# EasyEDA Pro project ir2104_V2.0.eprj

# Schematic Schematic1
Create Date: 2023-10-16; Page Name: P1_1; Project Name: ir2104_V2; Schematic Name: Schematic1; Update Date: 2023-10-16; Company: 嘉立创EDA; Page Size: A4; Version: V1.0
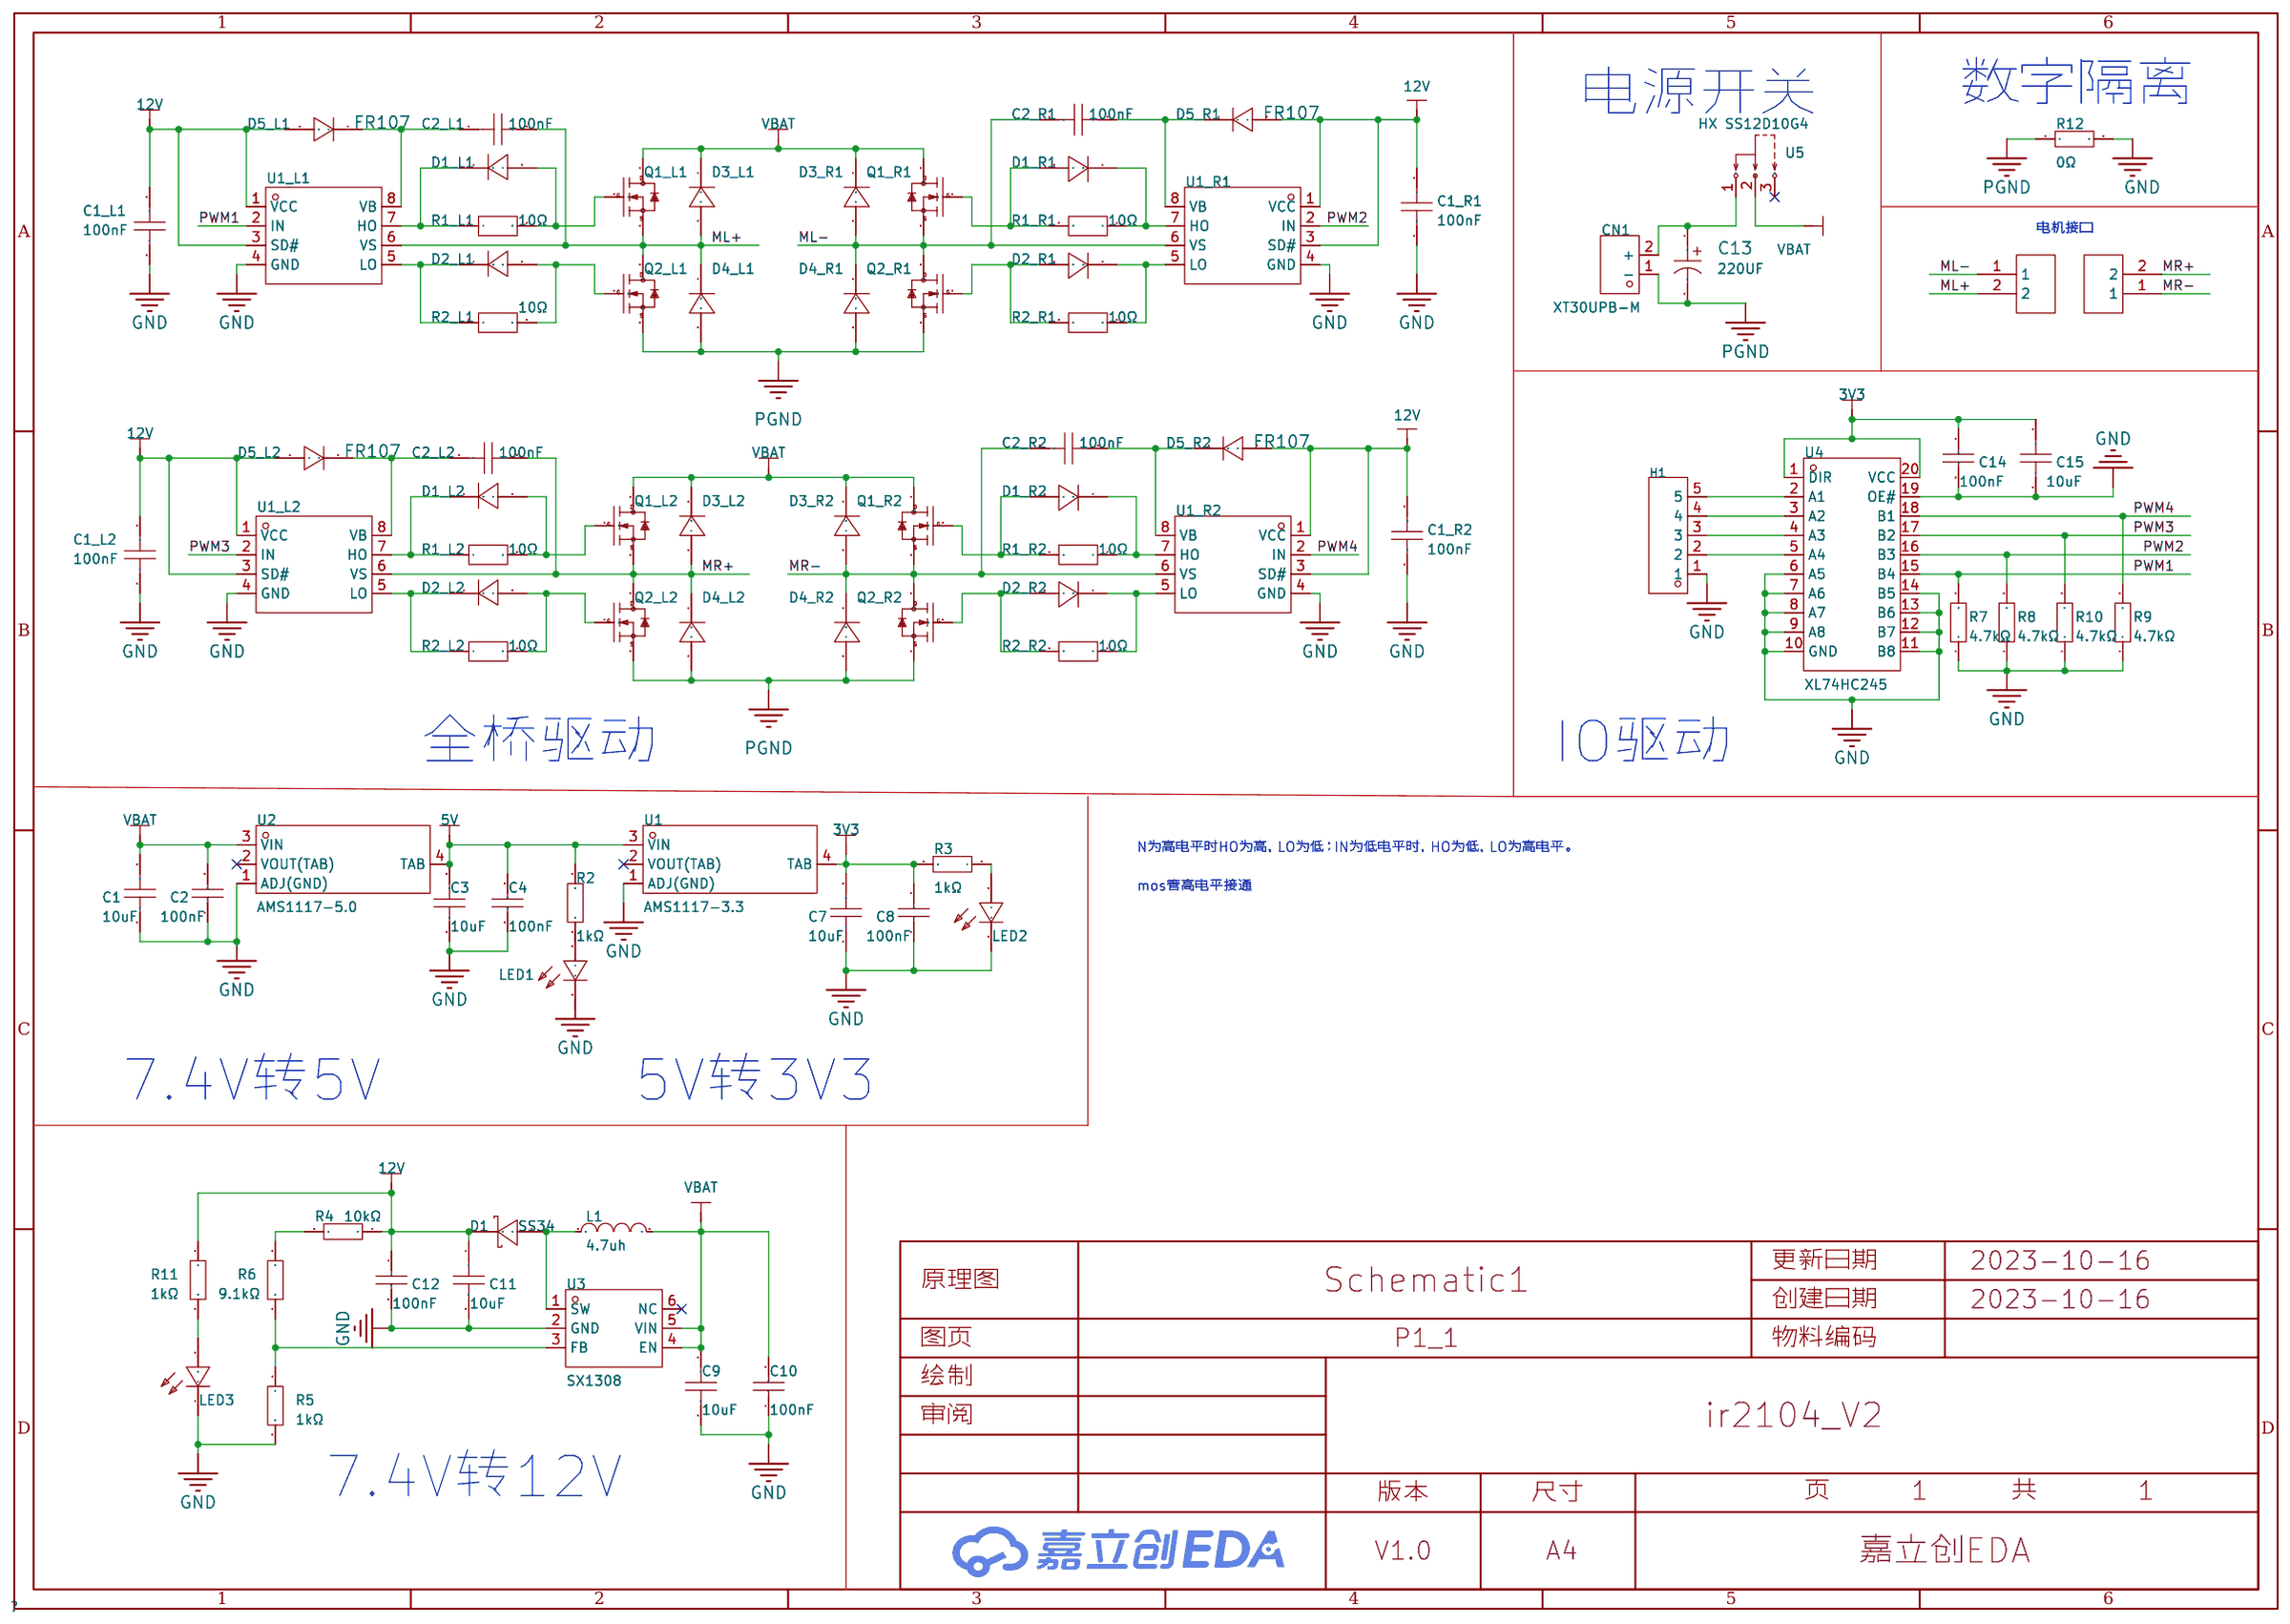
[diagram p0: schematic sheet]

## Parts
C1  10uF  [C0603]
C1_L1  100nF  [C0603]
C1_L2  100nF  [C0603]
C1_R1  100nF  [C0603]
C1_R2  100nF  [C0603]
C2  100nF  [C0603]
C2_L1  100nF  [C0603]
C2_L2  100nF  [C0603]
C2_R1  100nF  [C0603]
C2_R2  100nF  [C0603]
C3  10uF  [C0603]
C4  100nF  [C0603]
C7  10uF  [C0603]
C8  100nF  [C0603]
C9  10uF  [C0603]
C10  100nF  [C0603]
C11  10uF  [C0603]
C12  100nF  [C0603]
C13  220UF  [CAP-SMD_BD8.0-L8.3-W8.3-LS9.3-FD]
C14  100nF  [C0603]
C15  10uF  [C0603]
CN1  XT30UPB-M  [CONN-TH_XT30UPB-M]
D1  SS34  [SMA_L4.3-W2.6-LS5.2-RD]
D1_L1  US1M  [SMA_L4.4-W2.8-LS5.4-RD]
D1_L2  US1M  [SMA_L4.4-W2.8-LS5.4-RD]
D1_R1  US1M  [SMA_L4.4-W2.8-LS5.4-RD]
D1_R2  US1M  [SMA_L4.4-W2.8-LS5.4-RD]
D2_L1  US1M  [SMA_L4.4-W2.8-LS5.4-RD]
D2_L2  US1M  [SMA_L4.4-W2.8-LS5.4-RD]
D2_R1  US1M  [SMA_L4.4-W2.8-LS5.4-RD]
D2_R2  US1M  [SMA_L4.4-W2.8-LS5.4-RD]
D3_L1  US1M  [SMA_L4.4-W2.8-LS5.4-RD]
D3_L2  US1M  [SMA_L4.4-W2.8-LS5.4-RD]
D3_R1  US1M  [SMA_L4.4-W2.8-LS5.4-RD]
D3_R2  US1M  [SMA_L4.4-W2.8-LS5.4-RD]
D4_L1  US1M  [SMA_L4.4-W2.8-LS5.4-RD]
D4_L2  US1M  [SMA_L4.4-W2.8-LS5.4-RD]
D4_R1  US1M  [SMA_L4.4-W2.8-LS5.4-RD]
D4_R2  US1M  [SMA_L4.4-W2.8-LS5.4-RD]
D5_L1  FR107  [SOD-123_L2.8-W1.8-LS3.7-RD]
D5_L2  FR107  [SOD-123_L2.8-W1.8-LS3.7-RD]
D5_R1  FR107  [SOD-123_L2.8-W1.8-LS3.7-RD]
D5_R2  FR107  [SOD-123_L2.8-W1.8-LS3.7-RD]
H1  PZ254V-11-05P  [HDR-TH_5P-P2.54-V-M]
L1  4.7uh  [IND-SMD_L7.3-W6.6]
LED1  NCD0603R1  [LED0603-RD_RED]
LED2  NCD0603R1  [LED0603-RD_RED]
LED3  NCD0603R1  [LED0603-RD_RED]
P1  WJ500V-5.08-2P  [CONN-TH_2P-P5.00_WJ500V-5.08-2P]
P2  WJ500V-5.08-2P  [CONN-TH_2P-P5.00_WJ500V-5.08-2P]
Q1_L1  IRFR3607TRPBF  [TO-252-3_L6.5-W5.8-P4.58-BL]
Q1_L2  IRFR3607TRPBF  [TO-252-3_L6.5-W5.8-P4.58-BL]
Q1_R1  IRFR3607TRPBF  [TO-252-3_L6.5-W5.8-P4.58-BL]
Q1_R2  IRFR3607TRPBF  [TO-252-3_L6.5-W5.8-P4.58-BL]
Q2_L1  IRFR3607TRPBF  [TO-252-3_L6.5-W5.8-P4.58-BL]
Q2_L2  IRFR3607TRPBF  [TO-252-3_L6.5-W5.8-P4.58-BL]
Q2_R1  IRFR3607TRPBF  [TO-252-3_L6.5-W5.8-P4.58-BL]
Q2_R2  IRFR3607TRPBF  [TO-252-3_L6.5-W5.8-P4.58-BL]
R1_L1  10Ω  [R0603]
R1_L2  10Ω  [R0603]
R1_R1  10Ω  [R0603]
R1_R2  10Ω  [R0603]
R2  1kΩ  [R0603]
R2_L1  10Ω  [R0603]
R2_L2  10Ω  [R0603]
R2_R1  10Ω  [R0603]
R2_R2  10Ω  [R0603]
R3  1kΩ  [R0603]
R4  10kΩ  [R0603]
R5  1kΩ  [R0603]
R6  9.1kΩ  [R0603]
R7  4.7kΩ  [R0603]
R8  4.7kΩ  [R0603]
R9  4.7kΩ  [R0603]
R10  4.7kΩ  [R0603]
R11  1kΩ  [R0603]
R12  0Ω  [R0805]
U1  AMS1117-3.3  [SOT-223-4_L6.5-W3.5-P2.30-LS7.0-BR]
U1_L1  EG2104  [SOP-8_L5.0-W4.0-P1.27-LS6.2-BL]
U1_L2  EG2104  [SOP-8_L5.0-W4.0-P1.27-LS6.2-BL]
U1_R1  EG2104  [SOP-8_L5.0-W4.0-P1.27-LS6.2-BL]
U1_R2  EG2104  [SOP-8_L5.0-W4.0-P1.27-LS6.2-BL]
U2  AMS1117-5.0  [SOT-223_L6.7-W3.5-P2.30-BR]
U3  SX1308  [SOT-23-6_L2.9-W1.6-P0.95-LS2.8-BL]
U4  XL74HC245  [SOP-20_L12.8-W7.5-P1.27-LS10.4-BL]
U5  HX SS12D10G4  [SW-TH_SHOU-HAN_SS12D10G4]

## Library data of the parts
C1 C3 C7 C9 C11 C15 = CL10A106MA8NRNC: 容值:10uF;精度:±20%;额定电压:25V;材质(温度系数):X5R;; LCSC Part Name: 10uF ±20% 25V; Supplier Part: C96446; Manufacturer: SAMSUNG(三星); Supplier Footprint: 0603; JLCPCB Part Class: Basic Part; Datasheet: https://atta.szlcsc.com/upload/public/pdf/source/20170325/1490427913016.pdf; Supplier: LCSC; Tolerance: ±20%; Voltage Rated: 25V; Temperature Coefficient: X5R
C1_L1 C1_L2 C1_R1 C1_R2 C2_L1 C2_L2 C2_R1 C2_R2 = CL10B104KB8NNNC: 容值:100nF;精度:±10%;额定电压:50V;材质(温度系数):X7R;; LCSC Part Name: 100nF±10%50V; Supplier Part: C1591; Manufacturer: SAMSUNG(三星); Supplier Footprint: 0603; JLCPCB Part Class: 扩展库; Datasheet: https://atta.szlcsc.com/upload/public/pdf/source/20160103/1457707680512.pdf; Supplier: LCSC; Tolerance: ±10%; Voltage Rated: 50V; Temperature Coefficient: X7R
C2 C4 C8 C10 C12 C14 = 0603B104K500NT: 容值:100nF;精度:±10%;额定电压:50V;材质(温度系数):X7R;; LCSC Part Name: 100nF ±10% 50V; Supplier Part: C30926; Manufacturer: FH(风华); Supplier Footprint: 0603; JLCPCB Part Class: Extended Part; Datasheet: https://atta.szlcsc.com/upload/public/pdf/source/20170923/C30926_1506149436298988724.pdf; Supplier: LCSC; Tolerance: ±10%; Voltage Rated: 50V; Temperature Coefficient: X7R
C13 = FZ470UF16V90RV0148: LCSC Part Name: 贴片型铝电解电容 470UF 16V; Supplier Part: C5155342; Manufacturer: KNSCHA(科尼盛); Supplier Footprint: SMD,8x10.5mm; JLCPCB Part Class: Extended Part; Supplier: LCSC
CN1 = XT30UPB-M: LCSC Part Name: AMASS(艾迈斯)板载立式 航模锂电池控制器连接器插头 公头XT30UPB-M; Supplier Part: C428721; Manufacturer: AMASS(艾迈斯); JLCPCB Part Class: Extended Part; Datasheet: https://atta.szlcsc.com/upload/public/pdf/source/20230412/7B5DFEF57C9EA5273853390C734B3AC5.pdf; Supplier: LCSC
D1 = SS34_C8678: 二极管配置:独立式;直流反向耐压(Vr):40V;平均整流电流(Io):3A;正向压降(Vf):550mV@3A;; LCSC Part Name: 40V 3A 550mV@3A; Supplier Part: C8678; Manufacturer: MDD; Supplier Footprint: SMA(DO-214AC); JLCPCB Part Class: Basic Part; Datasheet: https://atta.szlcsc.com/upload/public/pdf/source/20230314/A80AE34493C69B89E2F4B1712F433538.pdf; Supplier: LCSC; Diode Configuration: 独立式; Reverse Voltage (Vr): 40V; Average Rectified Current (Io): 3A; Forward Voltage (Vf@If): 550mV@3A; Reverse Leakage Current (Ir): 500uA@40V
D1_L1 D1_L2 D1_R1 D1_R2 D2_L1 D2_L2 D2_R1 D2_R2 D3_L1 D3_L2 D3_R1 D3_R2 D4_L1 D4_L2 D4_R1 D4_R2 = US1M_C412437: 二极管配置:独立式;直流反向耐压(Vr):1kV;平均整流电流(Io):1A;正向压降(Vf):1.7V@1A;反向电流(Ir):5uA@1kV;反向恢复时间(trr):75ns;工作温度:-50℃~+150℃@(Tj);; LCSC Part Name: 1kV1A75ns; Supplier Part: C412437; Manufacturer: MDD; Supplier Footprint: SMA; JLCPCB Part Class: BasicPart; Datasheet: https://atta.szlcsc.com/upload/public/pdf/source/20200710/C412437_A2B0E4A2AF6F53946A2ACCD8257B288E.pdf; Supplier: LCSC; Diode Configuration: 独立式; Reverse Voltage (Vr): 1kV; Average Rectified Current (Io): 1A; Forward Voltage (Vf@If): 1.7V@1A; Reverse Leakage Current: 5uA@1kV; Reverse Recovery Time (trr): 75ns; Operating Temperature: -50℃~+150℃@(Tj)
D5_L1 D5_L2 D5_R1 D5_R2 = FR107_C511885: 二极管配置:-;直流反向耐压(Vr):1kV;平均整流电流(Io):1A;正向压降(Vf):1.3V@1A;反向电流(Ir):5uA@1kV;反向恢复时间(trr):500ns;工作温度:-55℃~+150℃@(Tj);; LCSC Part Name: 1kV1A500ns; Supplier Part: C511885; Manufacturer: BORN(伯恩半导体); Supplier Footprint: SOD-123; JLCPCB Part Class: 扩展库; Datasheet: https://atta.szlcsc.com/upload/public/pdf/source/20200413/C511885_F5BBF7A87475723E74BE0D118A106A7A.pdf; Supplier: LCSC; Reverse Voltage (Vr): 1kV; Average Rectified Current (Io): 1A; Forward Voltage (Vf@If): 1.3V@1A; Reverse Leakage Current: 5uA@1kV; Reverse Recovery Time (trr): 500ns; Operating Temperature: -55℃~+150℃@(Tj)
H1 = PZ254V-11-05P: 排数:单排;总PIN位数:5P;间距:2.54mm;插针结构:1x5P;行距:-;安装类型:直插;圆针/方针:方针;额定电流:-;额定电压:-;配合针长度:6mm;塑高:2.5mm;端接针长度:3mm;触头材质:黄铜;触头镀层:-;工作温度范围:-40℃~+105℃;颜色:黑色;; LCSC Part Name: 2.54mm 1x5P 直插 方针; Supplier Part: C492404; Manufacturer: XFCN(兴飞); Supplier Footprint: 插件,P=2.54mm; JLCPCB Part Class: Extended Part; Datasheet: https://atta.szlcsc.com/upload/public/pdf/source/20200309/C492404_E51533260F8710EFF5D4617281164C1D.pdf; Supplier: LCSC; Number of Rows: 单排; Number of Pins: 5P; Pitch: 2.54mm; Pin Structure: 1x5P; Mounting Type: 直插; Circluar Pins/Square Pins: 方针; Length of Mating Pin: 6mm; Insulation Height: 2.5mm; Length of End Connection Pin: 3mm; Contact Material: 黄铜; Operating Temperature Range: -40℃~+105℃; Color: 黑色
L1 = SMMS0630-100M: 电感值:10uH;精度:±20%;额定电流:-;; LCSC Part Name: 10uH ±20%; Supplier Part: C128692; Manufacturer: SXN(顺翔诺); Supplier Footprint: SMD,6.6x7.3mm; JLCPCB Part Class: 扩展库; Datasheet: https://atta.szlcsc.com/upload/public/pdf/source/20210810/BBF24330FB2F5029F637830BA9C42C0D.pdf; Supplier: LCSC; Tolerance: ±20%
LED1-LED3 = NCD0603R1_C84263: 发光颜色:红灯;; LCSC Part Name: 红灯; Supplier Part: C84263; Manufacturer: 国星光电; Supplier Footprint: 0603; JLCPCB Part Class: Extended Part; Datasheet: https://atta.szlcsc.com/upload/public/pdf/source/20200820/C84263_DABC6A75E58F576973B407FDBA283D60.pdf; Supplier: LCSC; Emitted Color: 红灯
P1 P2 = WJ500V-5.08-2P: 间距:5.08mm;结构:1x2P;排数:1;每排PIN数:2;安装方式:直针;额定电流:18A;额定电压:250V;线规 - AWG:14~30;线规 - mm2:2.5;工作温度范围:-40℃~+105℃;颜色:绿色;; LCSC Part Name: 5.08mm 1x2P 排数:1 每排P数:2 直针 可拼接; Supplier Part: C8465; Manufacturer: KANGNEX(康奈克斯电气); Supplier Footprint: 插件,P=5.08mm; JLCPCB Part Class: 扩展库; Datasheet: https://atta.szlcsc.com/upload/public/pdf/source/20191225/C8465_02D34CE5B5B4A53DF5891601D97FA9F4.pdf; Supplier: LCSC; Pitch: 5.08mm; Structure: 1x2P; Number of Rows: 1; Number of PINs Per Row: 2; Mounting Style: 直针; Current Rating (Max): 18A; Voltage Rating (Max): 250V; Wire Gauge - AWG: 14~30; Wire Gauge - mm2: 2.5; Operating Temperature Range: -40℃~+105℃; Color: 绿色
Q1_L1 Q1_L2 Q1_R1 Q1_R2 Q2_L1 Q2_L2 Q2_R1 Q2_R2 = IRFR3607TRPBF: 类型:N沟道;漏源电压(Vdss):75V;连续漏极电流(Id):56A;功率(Pd):140W;导通电阻(RDS(on)@Vgs,Id):9mΩ@10V,46A;阈值电压(Vgs(th)@Id):4V@100uA;; LCSC Part Name: N沟道75V56A; Supplier Part: C74775; Manufacturer: Infineon(英飞凌); Supplier Footprint: TO-252-2(DPAK); JLCPCB Part Class: 扩展库; Datasheet: https://atta.szlcsc.com/upload/public/pdf/source/20180125/C74775_15168616818461301901.pdf; Supplier: LCSC; Type: N沟道; Drain Source Voltage (Vdss): 75V; Continuous Drain Current (Id): 56A; Power Dissipation (Pd): 140W; Drain Source On Resistance (RDS(on)@Vgs,Id): 9mΩ@10V,46A; Gate Threshold Voltage (Vgs(th)@Id): 4V@100uA
R1_L1 R1_L2 R1_R1 R1_R2 R2_L1 R2_L2 R2_R1 R2_R2 = ERJUP3D10R0V: 阻值:10Ω;精度:±0.5%;功率:250mW;; LCSC Part Name: 10Ω±0.5%250mW; Supplier Part: C491216; Manufacturer: PANASONIC(松下); Supplier Footprint: 0603; JLCPCB Part Class: 扩展库; Datasheet: https://atta.szlcsc.com/upload/public/pdf/source/20200407/C491216_2E39EC09AE614A2EE2B1246D53854D38.pdf; Supplier: LCSC; Tolerance: ±0.5%; Power(Watts): 250mW
R2 R3 R11 = 0603WAF1001T5E: 电阻类型:厚膜电阻;阻值:1kΩ;精度:±1%;功率:100mW;; LCSC Part Name: 1kΩ ±1% 100mW; Supplier Part: C21190; Manufacturer: UNI-ROYAL(厚声); Supplier Footprint: 0603; JLCPCB Part Class: Basic Part; Datasheet: https://atta.szlcsc.com/upload/public/pdf/source/20200306/C422600_1E6D84923E4A46A82E41ADD87F860B5C.pdf; Supplier: LCSC; Type: 厚膜电阻; Tolerance: ±1%; Power(Watts): 100mW; Temperature Coefficient: ±100ppm/℃; Overload Voltage (Max): 75V; Operating Temperature Range: -55℃~+155℃
R4 = RT0603BRD0710KL: 电阻类型:薄膜电阻;阻值:10kΩ;精度:±0.1%;功率:100mW;; LCSC Part Name: 10kΩ ±0.1% 100mW; Supplier Part: C95204; Manufacturer: YAGEO(国巨); Supplier Footprint: 0603; JLCPCB Part Class: Extended Part; Datasheet: https://atta.szlcsc.com/upload/public/pdf/source/20170217/1487301593756.pdf; Supplier: LCSC; Type: 薄膜电阻; Tolerance: ±0.1%; Power(Watts): 100mW; Temperature Coefficient: ±25ppm/℃; Overload Voltage (Max): 75V; Operating Temperature Range: -55℃~+155℃
R5 = RT0603BRD071KL: 电阻类型:薄膜电阻;阻值:1kΩ;精度:±0.1%;功率:100mW;; LCSC Part Name: 1kΩ ±0.1% 100mW; Supplier Part: C110776; Manufacturer: YAGEO(国巨); Supplier Footprint: 0603; JLCPCB Part Class: Extended Part; Datasheet: https://atta.szlcsc.com/upload/public/pdf/source/20170704/1499151282044.pdf; Supplier: LCSC; Type: 薄膜电阻; Tolerance: ±0.1%; Power(Watts): 100mW; Temperature Coefficient: ±25ppm/℃; Overload Voltage (Max): 75V; Operating Temperature Range: -55℃~+155℃
R6 = PTFR0603B9K10P9: 电阻类型:薄膜电阻;阻值:9.1kΩ;精度:±0.1%;功率:100mW;; LCSC Part Name: 9.1kΩ ±0.1% 100mW; Supplier Part: C351620; Manufacturer: RESI(开步睿思）; Supplier Footprint: 0603; JLCPCB Part Class: Extended Part; Datasheet: https://atta.szlcsc.com/upload/public/pdf/source/20200421/C328426_1F8A6F869BB4A34F9E140D3E05CCCC70.pdf; Supplier: LCSC; Type: 薄膜电阻; Tolerance: ±0.1%; Power(Watts): 100mW; Temperature Coefficient: ±25ppm/℃; Overload Voltage (Max): 100V; Operating Temperature Range: -55℃~+125℃
R7-R10 = 0603WAF4701T5E: 电阻类型:厚膜电阻;阻值:4.7kΩ;精度:±1%;功率:100mW;; LCSC Part Name: 4.7kΩ ±1% 100mW; Supplier Part: C23162; Manufacturer: UNI-ROYAL(厚声); Supplier Footprint: 0603; JLCPCB Part Class: Basic Part; Datasheet: https://atta.szlcsc.com/upload/public/pdf/source/20200306/C422600_1E6D84923E4A46A82E41ADD87F860B5C.pdf; Supplier: LCSC; Type: 厚膜电阻; Tolerance: ±1%; Power(Watts): 100mW; Temperature Coefficient: ±100ppm/℃; Overload Voltage (Max): 75V; Operating Temperature Range: -55℃~+155℃
R12 = 0805W8F0000T5E: 电阻类型:厚膜电阻;阻值:0Ω;精度:±1%;功率:125mW;; LCSC Part Name: 0Ω ±1% 125mW; Supplier Part: C17477; Manufacturer: UNI-ROYAL(厚声); Supplier Footprint: 0805; JLCPCB Part Class: Basic Part; Datasheet: https://atta.szlcsc.com/upload/public/pdf/source/20200306/C422600_1E6D84923E4A46A82E41ADD87F860B5C.pdf; Supplier: LCSC; Type: 厚膜电阻; Tolerance: ±1%; Power(Watts): 125mW; Temperature Coefficient: ±800ppm/℃; Overload Voltage (Max): 150V; Operating Temperature Range: -55℃~+155℃
U1 = AMS1117-3.3_C347222: 输出类型:固定;输出极性:正;最大输入电压:18V;输出电压:3.3V;输出电流:1A;电源纹波抑制比(PSRR):60dB@(120Hz);; Supplier Part: C347222; Manufacturer: UMW(广东友台半导体); Supplier Footprint: SOT-223; JLCPCB Part Class: Extended Part; Datasheet: https://atta.szlcsc.com/upload/public/pdf/source/20211011/50CC665C22E3A66C08379A4A74BDA25C.pdf; Supplier: LCSC; Output Type: 固定; Output Polarity: 正; Number of Outputs: 1; Maximum Input Voltage: 18V; Output Voltage: 3.3V; Dropout Voltage: 1.3V@(1A); Output Current: 1A; Power Supply Rejection Ratio (PSRR): 60dB@(120Hz)
U1_L1 U1_L2 U1_R1 U1_R2 = EG2104: 高性价比,600V，半桥式Nmos预驱动器; Supplier Part: C186697; Manufacturer: EG(屹晶微); Supplier Footprint: SOP-8-150mil; JLCPCB Part Class: 扩展库; Datasheet: https://atta.szlcsc.com/upload/public/pdf/source/20220627/4CCFA0CAB664067FEE4AF87E4129127F.pdf; Supplier: LCSC
U2 = AMS1117-5.0_C347223: 输出类型:固定;输出极性:正;最大输入电压:18V;输出电压:5V;输出电流:1A;电源纹波抑制比(PSRR):60dB@(120Hz);; LCSC Part Name: 输入18V 输出5V 1A; Supplier Part: C347223; Manufacturer: UMW(广东友台半导体); Supplier Footprint: SOT-223; JLCPCB Part Class: Extended Part; Datasheet: https://atta.szlcsc.com/upload/public/pdf/source/20211011/50CC665C22E3A66C08379A4A74BDA25C.pdf; Supplier: LCSC; Output Type: 固定; Output Polarity: 正; Number of Outputs: 1; Maximum Input Voltage: 18V; Output Voltage: 5V; Dropout Voltage: 1.3V@(1A); Output Current: 1A; Power Supply Rejection Ratio (PSRR): 60dB@(120Hz)
U3 = SX1308: 功能类型:升压型;同步整流:否;输出通道数:1;拓扑结构:升压式;输入电压:2V~24V;输出电压:28V;输出电流(最大值):-;开关频率:1.2MHz;; LCSC Part Name: 升压型 Vin=2V~24V Vout=28V; Supplier Part: C78162; Manufacturer: SX(硕芯科技); Supplier Footprint: SOT-23-6; JLCPCB Part Class: Extended Part; Datasheet: https://atta.szlcsc.com/upload/public/pdf/source/20160920/1474356679185.pdf; Supplier: LCSC; Function: 升压型; Synchronous Rectification: 否; Number of Outputs: 1; Topology: 升压式; Input Voltage: 2V~24V; Output Voltage: 28V; Switching Frequency: 1.2MHz
U4 = XL74HC245: 八路总线收发器; LCSC Part Name: 总线收发器; Supplier Part: C561304; Manufacturer: XINLUDA(信路达); Supplier Footprint: SOP-20; JLCPCB Part Class: Extended Part; Datasheet: https://atta.szlcsc.com/upload/public/pdf/source/20200529/C561304_A214D245EEE9B91D1EB7AEB54AB3B76F.pdf; Supplier: LCSC
U5 = HX SS12D10G4: LCSC Part Name: 拨动开关 立式两档拨动,单排3脚插件,12.7x6.7x6.4,黑柄4mm; Supplier Part: C5149841; Manufacturer: hanxia(韩下); Supplier Footprint: 插件; JLCPCB Part Class: 扩展库; Datasheet: https://atta.szlcsc.com/upload/public/pdf/source/20220907/2020D7183ED16DD6E2B9F5A13FB144CF.pdf; Supplier: LCSC

## Nets
3V3: C7.2 C8.2 C14.1 C15.1 R3.2 U1.4(TAB) U4.1(DIR) U4.20(VCC)
5V: C3.2 C4.2 R2.1 U1.3(VIN) U2.4(TAB)
12V: C1_L1.2 C1_L2.2 C1_R1.2 C1_R2.2 C11.1 C12.1 D1.1(K) D5_L1.2(A) D5_L2.2(A) D5_R1.2(A) D5_R2.2(A) R4.1 R11.1 U1_L1.1(VCC) U1_L1.3(SD#) U1_L2.1(VCC) U1_L2.3(SD#) U1_R1.1(VCC) U1_R1.3(SD#) U1_R2.1(VCC) U1_R2.3(SD#)
GND: C1.1 C1_L1.1 C1_L2.1 C1_R1.1 C1_R2.1 C2.1 C3.1 C4.1 C7.1 C8.1 C9.1 C10.1 C11.2 C12.2 C14.2 C15.2 H1.1 LED1.1(K) LED2.1(K) LED3.1(K) R5.2 R7.1 R8.1 R9.1 R10.1 R12.2 U1.1(ADJ(GND)) U1_L1.4(GND) U1_L2.4(GND) U1_R1.4(GND) U1_R2.4(GND) U2.1(ADJ(GND)) U3.2(GND) U4.6(A5) U4.7(A6) U4.8(A7) U4.9(A8) U4.10(GND) U4.11(B8) U4.12(B7) U4.13(B6) U4.14(B5) U4.19(OE#)
PGND: C13.2 CN1.1(-) D4_L1.2(A) D4_L2.2(A) D4_R1.2(A) D4_R2.2(A) Q2_L1.3(S) Q2_L2.3(S) Q2_R1.3(S) Q2_R2.3(S) R12.1
VBAT: C1.2 C2.2 C9.2 C10.2 D3_L1.1(C) D3_L2.1(C) D3_R1.1(C) D3_R2.1(C) L1.2 Q1_L1.2(D) Q1_L2.2(D) Q1_R1.2(D) Q1_R2.2(D) U2.3(VIN) U3.4(EN) U3.5(VIN) U5.2
ML+: C2_L1.2 D3_L1.2(A) D4_L1.1(C) P1.2 Q1_L1.3(S) Q2_L1.2(D) U1_L1.6(VS)
ML-: C2_R1.2 D3_R1.2(A) D4_R1.1(C) P1.1 Q1_R1.3(S) Q2_R1.2(D) U1_R1.6(VS)
MR+: C2_L2.2 D3_L2.2(A) D4_L2.1(C) P2.2 Q1_L2.3(S) Q2_L2.2(D) U1_L2.6(VS)
MR-: C2_R2.2 D3_R2.2(A) D4_R2.1(C) P2.1 Q1_R2.3(S) Q2_R2.2(D) U1_R2.6(VS)
PWM1: R7.2 U1_L1.2(IN) U4.15(B4)
PWM2: R8.2 U1_R1.2(IN) U4.16(B3)
PWM3: R10.2 U1_L2.2(IN) U4.17(B2)
PWM4: R9.2 U1_R2.2(IN) U4.18(B1)
$3N995: D2_L1.2(A) Q2_L1.1(G) R2_L1.2
$3N996: D1_L1.1(C) R1_L1.1 U1_L1.7(HO)
$3N997: D2_L1.1(C) R2_L1.1 U1_L1.5(LO)
$3N999: C2_L1.1 D5_L1.1(K) U1_L1.8(VB)
$3N1006: D1_R1.1(C) R1_R1.1 U1_R1.7(HO)
$3N1007: D1_R1.2(A) Q1_R1.1(G) R1_R1.2
$3N1008: D2_R1.1(C) R2_R1.1 U1_R1.5(LO)
$3N1009: D2_R1.2(A) Q2_R1.1(G) R2_R1.2
$3N1011: C2_R1.1 D5_R1.1(K) U1_R1.8(VB)
$3N1019: D1_L1.2(A) Q1_L1.1(G) R1_L1.2
$3N2169: D2_L2.2(A) Q2_L2.1(G) R2_L2.2
$3N2170: D1_L2.1(C) R1_L2.1 U1_L2.7(HO)
$3N2171: D2_L2.1(C) R2_L2.1 U1_L2.5(LO)
$3N2173: C2_L2.1 D5_L2.1(K) U1_L2.8(VB)
$3N2190: D1_R2.1(C) R1_R2.1 U1_R2.7(HO)
$3N2191: D1_R2.2(A) Q1_R2.1(G) R1_R2.2
$3N2192: D2_R2.1(C) R2_R2.1 U1_R2.5(LO)
$3N2193: D2_R2.2(A) Q2_R2.1(G) R2_R2.2
$3N2195: C2_R2.1 D5_R2.1(K) U1_R2.8(VB)
$3N2213: D1_L2.2(A) Q1_L2.1(G) R1_L2.2
$3N2727: LED2.2(A) R3.1
$3N2731: LED1.2(A) R2.2
$3N3245: D1.2(A) L1.1 U3.1(SW)
$3N3247: R4.2 R6.2
$3N3248: R5.1 R6.1 U3.3(FB)
$3N3249: LED3.2(A) R11.2
$3N4108: C13.1 CN1.2(+) U5.1
$3N4523: H1.2 U4.5(A4)
$3N4524: H1.3 U4.4(A3)
$3N4525: H1.4 U4.3(A2)
$3N4526: H1.5 U4.2(A1)

Not connected (* = marked no-connect by the designer): U1 2(VOUT(TAB))*; U2 2(VOUT(TAB))*; U3 6(NC)*; U5 3*

## Notes on the sheet
- 数字隔离
- 电源开关
- 电机接口
- 全桥驱动
- IO驱动
- N为高电平时HO为高，LO为低；IN为低电平时，HO为低，LO为高电平。
- mos管高电平接通
- 7.4V转5V
- 5V转3V3
- 7.4V转12V

# Board PCB1
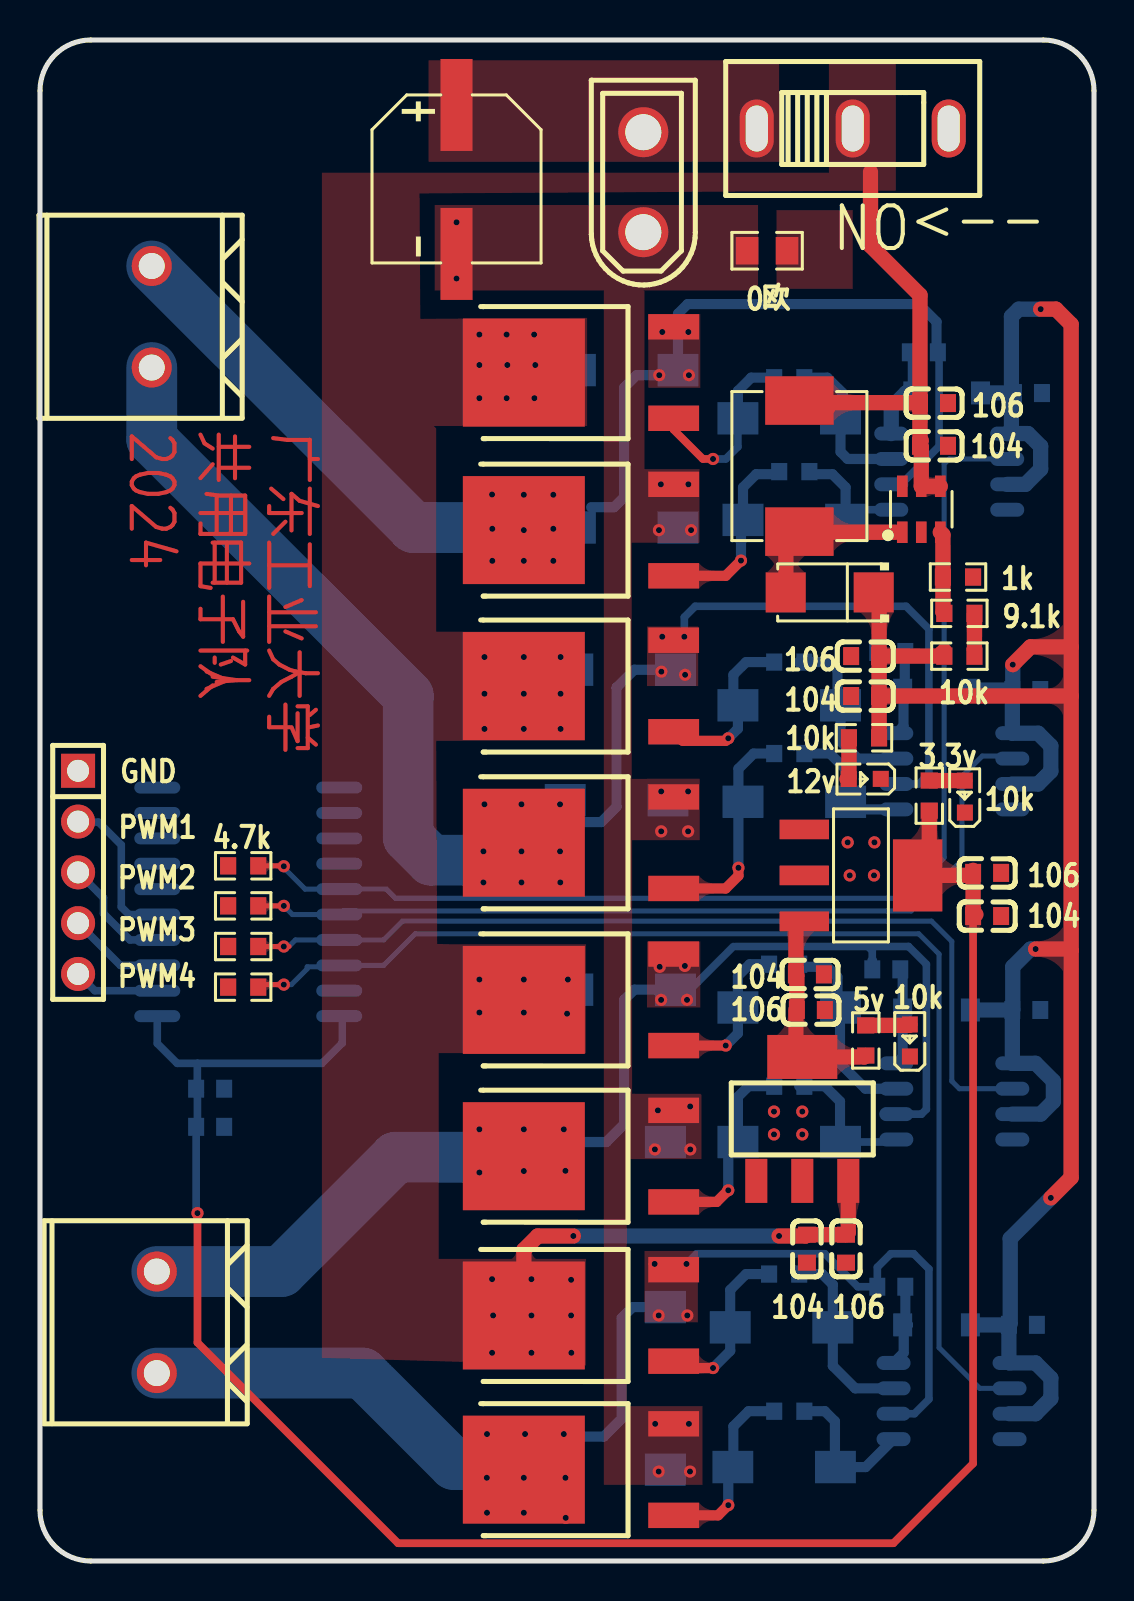
[diagram p1: board, top side]
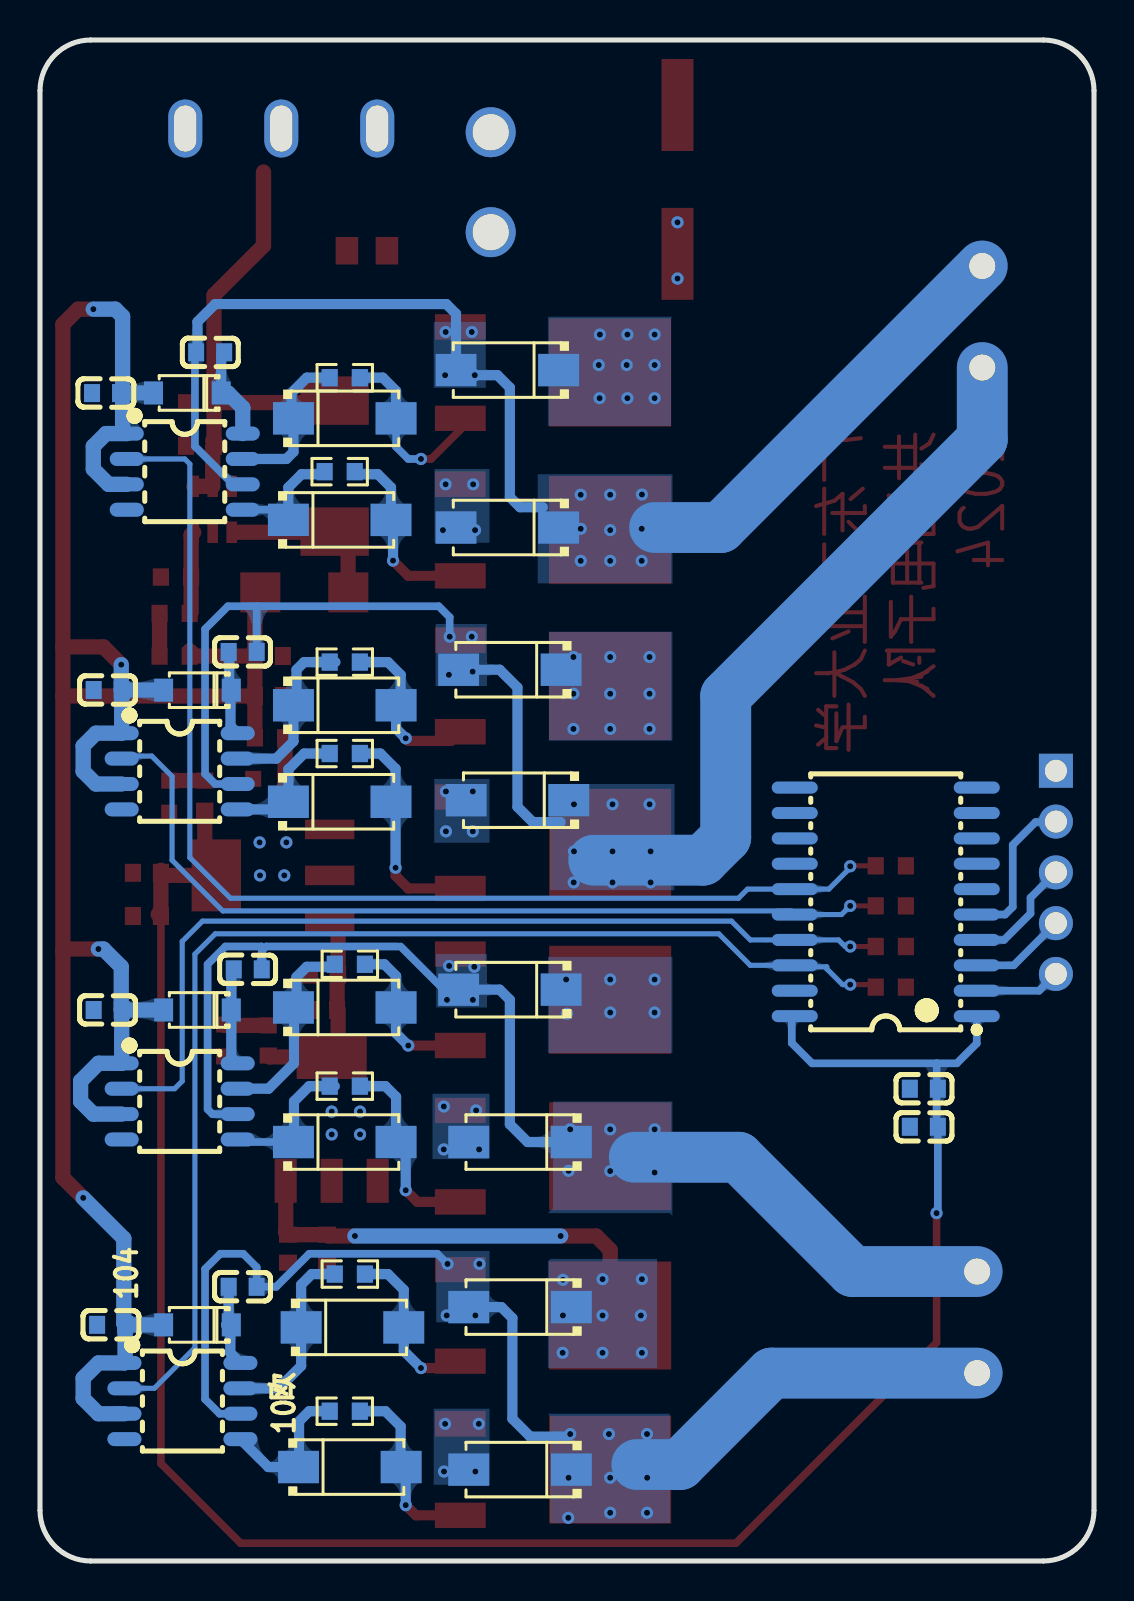
[diagram p2: board, bottom side, seen from below]

Outline 52.71 x 76.07 mm; copper layers: Top Layer, Bottom Layer. Coordinates in mm from the lower left corner of the outline.
Outline path: 0,73.53 0,2.54 arc(0.74,0.74) 2.54,0 50.16,0 arc(51.96,0.74) 52.71,2.54 52.71,73.53 arc(51.96,75.33) 50.16,76.07 2.54,76.07 arc(0.74,75.33) 0,73.53
Stack: Top Layer 0.035mm / Dielectric1 1.51mm FR4 er 4.5 / Bottom Layer 0.035mm

## Design rules (mm)
template: JLCPCB Capability(Two Layers Board)
spacing copperThickness1oz (default): track to track 0.102, other pairs 0.152 to 0.3
spacing copperThickness2oz: track to track 0.203, other pairs 0.152 to 0.3
track width copperThickness1oz (default): min 0.127, default 0.254, max 2.54
track width copperThickness2oz: min 0.203, default 0.254, max 2.54
differential pair differentialPair (default): width min 0.127, default 0.254, max 2.54; gap min 0.152, default 0.152
via viaSize (default): diameter min 0.5, default 0.61, max 10; hole min 0.3, default 0.305, max 6.3

## Placement (name value [footprint] x y rotation side)
C1  10uF  [C0603]  40.3 15.62 90 top
C1_L1  100nF  [C0603]  49.4 58.41 180 bottom
C1_L2  100nF  [C0603]  49.32 27.56 180 bottom
C1_R1  100nF  [C0603]  49.32 43.56 180 bottom
C1_R2  100nF  [C0603]  49.15 11.81 180 bottom
C2  100nF  [C0603]  38.35 15.62 90 top
C2_L1  100nF  [C0603]  44.2 60.45 0 bottom
C2_L2  100nF  [C0603]  42.32 29.59 180 bottom
C2_R1  100nF  [C0603]  42.57 45.47 180 bottom
C2_R2  100nF  [C0603]  42.57 13.72 180 bottom
C3  10uF  [C0603]  38.55 27.56 180 top
C4  100nF  [C0603]  38.5 29.34 180 top
C7  10uF  [C0603]  47.36 34.42 180 top
C8  100nF  [C0603]  47.36 32.26 180 top
C9  10uF  [C0603]  44.7 57.91 180 top
C10  100nF  [C0603]  44.7 55.78 180 top
C11  10uF  [C0603]  41.26 45.26 180 top
C12  100nF  [C0603]  41.26 43.26 180 top
C13  220UF  [CAP-SMD_BD8.0-L8.3-W8.3-LS9.3-FD]  20.83 69.1 270 top
C14  100nF  [C0603]  8.51 23.62 0 bottom
C15  10uF  [C0603]  8.51 21.72 0 bottom
CN1  XT30UPB-M  [CONN-TH_XT30UPB-M]  30.17 68.96 90 top
D1  SS34  [SMA_L4.3-W2.6-LS5.2-RD]  39.49 48.44 180 top
D1_L1  US1M  [SMA_L4.4-W2.8-LS5.4-RD]  37.47 57.15 180 bottom
D1_L2  US1M  [SMA_L4.4-W2.8-LS5.4-RD]  37.47 27.69 180 bottom
D1_R1  US1M  [SMA_L4.4-W2.8-LS5.4-RD]  37.47 42.8 180 bottom
D1_R2  US1M  [SMA_L4.4-W2.8-LS5.4-RD]  37.08 11.68 180 bottom
D2_L1  US1M  [SMA_L4.4-W2.8-LS5.4-RD]  37.72 52.07 180 bottom
D2_L2  US1M  [SMA_L4.4-W2.8-LS5.4-RD]  37.47 20.95 180 bottom
D2_R1  US1M  [SMA_L4.4-W2.8-LS5.4-RD]  37.72 37.97 180 bottom
D2_R2  US1M  [SMA_L4.4-W2.8-LS5.4-RD]  37.21 4.7 180 bottom
D3_L1  US1M  [SMA_L4.4-W2.8-LS5.4-RD]  29.34 59.56 0 bottom
D3_L2  US1M  [SMA_L4.4-W2.8-LS5.4-RD]  29.21 28.57 0 bottom
D3_R1  US1M  [SMA_L4.4-W2.8-LS5.4-RD]  29.21 44.58 0 bottom
D3_R2  US1M  [SMA_L4.4-W2.8-LS5.4-RD]  28.7 12.7 0 bottom
D4_L1  US1M  [SMA_L4.4-W2.8-LS5.4-RD]  29.34 51.69 0 bottom
D4_L2  US1M  [SMA_L4.4-W2.8-LS5.4-RD]  28.7 20.95 0 bottom
D4_R1  US1M  [SMA_L4.4-W2.8-LS5.4-RD]  28.83 38.05 0 bottom
D4_R2  US1M  [SMA_L4.4-W2.8-LS5.4-RD]  28.7 4.57 0 bottom
D5_L1  FR107  [SOD-123_L2.8-W1.8-LS3.7-RD]  45.34 58.42 0 bottom
D5_L2  FR107  [SOD-123_L2.8-W1.8-LS3.7-RD]  44.83 27.56 0 bottom
D5_R1  FR107  [SOD-123_L2.8-W1.8-LS3.7-RD]  44.83 43.55 0 bottom
D5_R2  FR107  [SOD-123_L2.8-W1.8-LS3.7-RD]  44.83 11.81 0 bottom
H1  PZ254V-11-05P  [HDR-TH_5P-P2.54-V-M]  1.91 34.44 270 top
L1  4.7uh  [IND-SMD_L7.3-W6.6]  37.97 54.76 270 top
LED1  NCD0603R1  [LED0603-RD_RED]  43.5 26.03 90 top
LED2  NCD0603R1  [LED0603-RD_RED]  46.25 38.23 90 top
LED3  NCD0603R1  [LED0603-RD_RED]  41.24 39.12 180 top
P1  WJ500V-5.08-2P  [CONN-TH_2P-P5.00_WJ500V-5.08-2P]  5.59 62.23 90 top
P2  WJ500V-5.08-2P  [CONN-TH_2P-P5.00_WJ500V-5.08-2P]  5.84 11.94 90 top
Q1_L1  IRFR3607TRPBF  [TO-252-3_L6.5-W5.8-P4.58-BL]  27.94 59.44 90 top
Q1_L2  IRFR3607TRPBF  [TO-252-3_L6.5-W5.8-P4.58-BL]  27.94 28.07 90 top
Q1_R1  IRFR3607TRPBF  [TO-252-3_L6.5-W5.8-P4.58-BL]  27.94 43.76 90 top
Q1_R2  IRFR3607TRPBF  [TO-252-3_L6.5-W5.8-P4.58-BL]  27.94 12.28 90 top
Q2_L1  IRFR3607TRPBF  [TO-252-3_L6.5-W5.8-P4.58-BL]  27.94 51.56 90 top
Q2_L2  IRFR3607TRPBF  [TO-252-3_L6.5-W5.8-P4.58-BL]  27.94 20.25 90 top
Q2_R1  IRFR3607TRPBF  [TO-252-3_L6.5-W5.8-P4.58-BL]  27.94 35.92 90 top
Q2_R2  IRFR3607TRPBF  [TO-252-3_L6.5-W5.8-P4.58-BL]  27.94 4.57 90 top
R1_L1  10Ω  [R0603]  37.47 59.18 180 bottom
R1_L2  10Ω  [R0603]  37.21 29.84 180 bottom
R1_R1  10Ω  [R0603]  37.47 44.96 180 bottom
R1_R2  10Ω  [R0603]  37.21 14.35 180 bottom
R2  1kΩ  [R0603]  41.29 26.03 90 top
R2_L1  10Ω  [R0603]  37.72 54.48 180 bottom
R2_L2  10Ω  [R0603]  37.47 23.75 180 bottom
R2_R1  10Ω  [R0603]  37.47 40.39 180 bottom
R2_R2  10Ω  [R0603]  37.47 7.49 180 bottom
R3  1kΩ  [R0603]  44.47 38.28 270 top
R4  10kΩ  [R0603]  45.97 45.26 0 top
R5  1kΩ  [R0603]  45.9 49.21 0 top
R6  9.1kΩ  [R0603]  45.97 47.39 0 top
R7  4.7kΩ  [R0603]  10.16 34.77 0 top
R8  4.7kΩ  [R0603]  10.16 32.77 0 top
R9  4.7kΩ  [R0603]  10.16 28.7 0 top
R10  4.7kΩ  [R0603]  10.16 30.73 0 top
R11  1kΩ  [R0603]  41.2 41.17 180 top
R12  0Ω  [R0805]  36.36 65.53 0 top
U1  AMS1117-3.3  [SOT-223-4_L6.5-W3.5-P2.30-LS7.0-BR]  41.05 34.29 180 top
U1_L1  EG2104  [SOP-8_L5.0-W4.0-P1.27-LS6.2-BL]  45.47 54.48 270 bottom
U1_L2  EG2104  [SOP-8_L5.0-W4.0-P1.27-LS6.2-BL]  45.72 22.99 270 bottom
U1_R1  EG2104  [SOP-8_L5.0-W4.0-P1.27-LS6.2-BL]  45.72 39.5 270 bottom
U1_R2  EG2104  [SOP-8_L5.0-W4.0-P1.27-LS6.2-BL]  45.58 8 270 bottom
U2  AMS1117-5.0  [SOT-223_L6.7-W3.5-P2.30-BR]  38.12 22.11 270 top
U3  SX1308  [SOT-23-6_L2.9-W1.6-P0.95-LS2.8-BL]  44.07 52.6 0 top
U4  XL74HC245  [SOP-20_L12.8-W7.5-P1.27-LS10.4-BL]  10.41 32.97 90 bottom
U5  HX SS12D10G4  [SW-TH_SHOU-HAN_SS12D10G4]  40.64 71.65 0 top

## Footprints (pads in the part's own frame, mm; a bottom-side part is the same pattern mirrored in y, then rotated)
C0603
  rect 0.8x0.9 smd: 1(-0.7,0) 2(0.7,0)
CAP-SMD_BD8.0-L8.3-W8.3-LS9.3-FD
  rect 4.6x1.6 smd: 1(-3.724,0) 2(3.724,0)
CONN-TH_2P-P5.00_WJ500V-5.08-2P
  round 2 hole 1.3: 1(-2.54,0) 2(2.54,0)
CONN-TH_XT30UPB-M
  round 2.5 hole 1.8: 1(-2.5,0) 2(2.5,0)
HDR-TH_5P-P2.54-V-M
  rect 1.7x1.7 hole 1.1: 1(-5.08,0)
  round 1.7 hole 1.1: 2(-2.54,0) 3(0,0) 4(2.54,0) 5(5.08,0)
IND-SMD_L7.3-W6.6
  rect 2.424x3.42 smd: 1(3.278,0) 2(-3.278,0)
LED0603-RD_RED
  rect 0.8x0.8 smd: 1(-0.799,-0.004) 2(0.799,0.004)
R0603
  rect 0.806x0.864 smd: 1(-0.753,0) 2(0.753,0)
R0805
  rect 1.133x1.377 smd: 1(-1,0) 2(1,0)
SMA_L4.3-W2.6-LS5.2-RD
  rect 2x2 smd: 1(-2.2,0) 2(2.2,0)
SMA_L4.4-W2.8-LS5.4-RD
  rect 2.046x1.62 smd: 1(-2.566,0) 2(2.566,0)
SOD-123_L2.8-W1.8-LS3.7-RD
  rect 0.95x1.15 smd: 1(-1.692,0) 2(1.692,0)
SOP-8_L5.0-W4.0-P1.27-LS6.2-BL
  oval 0.7x1.7 smd: 1(-1.905,-2.9) 2(-0.635,-2.9) 3(0.635,-2.9) 4(1.905,-2.9) 5(1.905,2.9) 6(0.635,2.9) 7(-0.635,2.9) 8(-1.905,2.9)
SOP-20_L12.8-W7.5-P1.27-LS10.4-BL
  oval 0.6x2.3 smd: 1(-5.715,-4.55) 2(-4.445,-4.55) 3(-3.175,-4.55) 4(-1.905,-4.55) 5(-0.635,-4.55) 6(0.635,-4.55) 7(1.905,-4.55) 8(3.175,-4.55) 9(4.445,-4.55) 10(5.715,-4.55) 11(5.715,4.55) 12(4.445,4.55) 13(3.175,4.55) 14(1.905,4.55) 15(0.635,4.55) 16(-0.635,4.55) 17(-1.905,4.55) 18(-3.175,4.55) 19(-4.445,4.55) 20(-5.715,4.55)
SOT-23-6_L2.9-W1.6-P0.95-LS2.8-BL
  rect 0.532x1.072 smd: 1(-0.95,-1.149) 2(0,-1.149) 3(0.95,-1.149) 4(0.95,1.149) 5(0,1.149) 6(-0.95,1.149)
SOT-223-4_L6.5-W3.5-P2.30-LS7.0-BR
  rect 2.47x0.98 smd: 1(2.835,-2.3) 2(2.835,0) 3(2.835,2.3)
  rect 2.47x3.6 smd: 4(-2.835,0)
SOT-223_L6.7-W3.5-P2.30-BR
  rect 2.2x1.1 smd: 1(3.099,-2.3) 2(3.099,0) 3(3.099,2.3)
  rect 2.2x3.5 smd: 4(-3.099,0)
SW-TH_SHOU-HAN_SS12D10G4
  oval 1.7x2.9 hole 1.1x2.3: 1(-4.8,0) 2(0,0) 3(4.8,0)
TO-252-3_L6.5-W5.8-P4.58-BL
  rect 1.27x2.54 smd: 1(-2.288,-3.747) 3(2.288,-3.745)
  rect 5.4x6.1 smd: 2(-0.002,3.747)

## Nets
As in the schematic.

Pads without a net: U1 2; U2 2; U3 6; U5 3

## Via types
v1: diameter 0.61, hole 0.305, Top Layer to Bottom Layer, 127 vias

## Routing (per net, layer and track width the routed paths; a pad name or vN(x,y) marks a point on that pad's centre or on a via; arc(x,y) is an arc through that point)
3V3: length 107.5
  Top Layer w0.381: v1(7.87,17.4) 7.87,10.92 17.91,0.89 42.67,0.89 46.66,4.88 C8.2
  Top Layer w0.762: 46.66,34.54 46.4,34.29 U1.4 44.47,34.87 R3.2 ; 46.8,32.34 46.66,32.48 C7.2
  Bottom Layer w0.381: 7.87,24.89 14.1,24.89 15.11,25.91 15.11,27.1 U4.20 ; 7.87,24.89 7.87,23.59 8.01,23.45 7.87,23.3 7.87,21.78 7.81,21.72 7.81,17.46 v1(7.87,17.4) ; 7.87,24.89 6.86,24.89 5.86,25.89 U4.1
  vias: v1(36.7,22.48) v1(36.7,21.34) v1(38.12,22.48) v1(38.12,21.34) v1(40.39,35.94) v1(40.49,34.29) v1(41.72,35.94) v1(41.7,34.29)
5V: length 10.6
  Top Layer w0.762: R2.1 41.22,25.21 U2.4 37.8,25.53 37.8,27.56 ; C3.2 37.85,29.29 C4.2 37.8,31.99 U1.3
12V: length 127.5
  Top Layer w0.762: C11.1 41.96,47.9 41.7,48.17 41.7,48.44 ; C11.1 C12.1 ; C11.1 44.95,45.26 45.22,45.53 ; 51.56,45.72 51.56,61.85 50.8,62.61 v1(50.04,62.61) ; 51.56,45.72 49.53,45.72 v1(48.64,44.83) ; 51.56,45.72 51.56,43.26 ; v1(49.78,30.61) 51.49,30.61 51.56,30.53 ; C12.1 51.56,43.26 ; C12.1 41.96,41.17 R11.1 ; v1(50.55,18.16) 51.56,19.18 51.56,30.53 ; 51.56,43.26 51.56,30.53
  Bottom Layer w0.762: 48.37,53.85 49.28,53.85 50.04,54.61 50.04,55.75 49.4,56.39 U1_L1.1 48.58,56.6 48.58,58.42 ; 48.58,58.42 48.58,62.25 48.94,62.61 v1(50.04,62.61) ; 48.58,58.42 D5_L1.2 ; C1_R2.2 48.45,9.94 U1_R2.1 49.78,9.91 50.55,9.14 50.55,8.13 49.78,7.37 48.48,7.37 ; C1_R2.2 48.51,11.88 48.51,16.13 v1(50.55,18.16) ; C1_R2.2 48.44,11.81 46.78,11.81 ; v1(49.78,30.61) 49.53,30.61 48.64,29.72 48.64,27.58 C1_L2.2 ; v1(48.64,44.83) 48.64,43.58 C1_R1.2 ; C1_R1.2 46.53,43.56 D5_R1.2 ; C1_R1.2 U1_R1.1 49.91,41.4 50.55,40.77 50.55,39.5 49.91,38.86 U1_R1.3 ; U1_L2.3 50.04,22.35 50.67,22.99 50.67,24 49.78,24.89 U1_L2.1 C1_L2.2 ; C1_L2.2 D5_L2.2
PGND:
  vias: v1(20.83,66.95) v1(20.83,64.14) v1(30.75,20.59) v1(30.76,6.86) v1(30.95,51.56) v1(30.9,22.54) v1(30.94,4.48) v1(31.05,53.85) v1(31.06,38.49) v1(31.06,36.49) v1(32.42,53.85) v1(32.41,38.49) v1(32.41,36.49) v1(32.45,6.86) v1(32.56,51.56) v1(32.51,22.73) v1(32.52,20.59) v1(32.5,4.48)
VBAT: length 47.1
  Top Layer w0.762: v1(36.96,16.26) 38.28,16.26 C2.2 C1.2 40.42,16.44 U2.3 ; L1.2 39.05,58.04 39.15,57.94 ; U3.4 U3.5 44.07,55.71 C10.2 ; 44,57.94 44,56.1 44.07,56.03 ; 44,57.94 44,63.31 41.53,65.79 41.53,69.47 ; 44,57.94 39.15,57.94 ; v1(26.67,16.26) 24.89,16.26 24.19,15.56 24.19,12.41 ; 39.15,57.94 38.26,57.94 ; 39.15,57.94 39.41,57.68
  Bottom Layer w0.762: v1(36.96,16.26) v1(26.67,16.26)
  vias: v1(21.97,61.34) v1(21.97,59.82) v1(21.97,58.16) v1(21.97,29.08) v1(21.97,27.43) v1(22.22,45.21) v1(22.23,43.38) v1(22.23,41.62) v1(22.61,14.1) v1(22.66,12.28) v1(22.61,10.41) v1(23.33,61.34) v1(23.37,59.82) v1(23.33,58.16) v1(24.19,45.21) v1(24.19,43.38) v1(24.19,41.62) v1(24.19,29.08) v1(24.19,27.43) v1(24.57,14.1) v1(24.57,12.28) v1(24.57,10.41) v1(24.71,61.34) v1(24.77,59.82) v1(24.72,58.16) v1(26.03,45.21) v1(26.03,43.38) v1(26.03,41.62) v1(26.36,27.37) v1(26.4,29.08) v1(26.56,14.06) v1(26.56,12.28) v1(26.57,10.41)
ML+: length 57.7
  Bottom Layer w0.381: 42.57,53.85 43.05,53.85 44.96,55.75 44.96,60.39 C2_L1.2
  Bottom Layer w0.508: 27.56,52.7 28.7,52.7 29.21,53.21 29.21,58.69 29.83,59.31 v1(30.96,59.31) 31.65,59.31 D3_L1.2 31.9,62.38 32.38,62.86 43.94,62.86 44.83,61.98 44.83,60.64
  Bottom Layer w2.54: P1.2 18.67,51.69 21.97,51.69
  vias: v1(22.61,53.34) v1(22.62,51.63) v1(22.62,50.02) v1(24.19,53.33) v1(24.19,51.56) v1(24.19,50.02) v1(25.67,53.33) v1(25.67,51.63) v1(25.67,50.02) v1(31.12,61.47) v1(32.42,61.47) v1(32.45,59.31)
ML-: length 72.9
  Bottom Layer w0.381: 41.87,47.75 C2_R1.2 ; 41.87,47.75 32.77,47.75 32.22,47.2 v1(32.22,46.23) ; 41.87,47.75 43.31,47.75 44.45,46.61 44.45,39.37 43.94,38.86 U1_R1.6
  Bottom Layer w0.508: D3_R1.2 29.72,44.58 28.83,43.69 28.83,37.72 28.07,36.96 26.67,36.96
  Bottom Layer w2.54: P1.1 5.59,56.1 18.41,43.27 18.41,36.19 19.56,35.05 25.02,35.05
  vias: v1(22.17,35.49) v1(22.17,33.94) v1(22.22,37.85) v1(24.08,37.85) v1(24.08,35.49) v1(24.08,33.94) v1(26,37.85) v1(26,35.49) v1(26.02,33.94) v1(31.07,44.48) v1(31.12,46.23) v1(32.26,44.32)
MR+: length 55.7
  Bottom Layer w0.381: D3_L2.2 32.51,28.57 34.67,30.73 ; 41.62,30.01 41.62,30.52 ; 41.62,30.52 41.4,30.73 34.8,30.73 ; 41.62,30.52 41.62,30.73 43.43,30.73 44.32,29.84 44.32,22.59 44.08,22.35 U1_L2.6
  Bottom Layer w0.508: D3_L2.2 29.72,28.57 29.21,28.07 29.21,21.84 28.32,20.95 D4_L2.1 ; C2_L2.2 41.62,30.01
  Bottom Layer w2.54: 22.99,20.19 17.78,20.19 12.06,14.48 P2.2
  vias: v1(21.97,21.59) v1(21.97,19.43) v1(24.19,21.59) v1(24.19,19.5) v1(26.19,21.59) v1(26.27,19.52) v1(30.99,29.72) v1(31.06,28.06) v1(32.25,29.76) v1(32.35,28.06)
MR-: length 52.8
  Bottom Layer w0.381: v1(32.33,14.86) 32.84,15.37 39.24,15.37 40.89,13.72 C2_R2.2 41.87,14.69 42.55,15.37 43.69,15.37 44.45,14.6 44.45,8.09 43.72,7.37 42.68,7.37
  Bottom Layer w0.508: v1(26.19,6.35) 26.32,6.22 28.19,6.22 29.08,7.11 29.08,12.15 29.63,12.7 D3_R2.2
  Bottom Layer w2.54: 22.86,4.83 20.7,4.83 16.13,9.4 P2.1
  vias: v1(22.35,6.35) v1(22.34,4.16) v1(22.35,2.41) v1(24.26,6.35) v1(24.19,4.16) v1(24.19,2.41) v1(26.27,4.16) v1(26.29,2.16) v1(30.73,14.86) v1(30.94,12.28) v1(32.37,12.28)
PWM1: length 58.8
  Top Layer w0.254: R7.2 12.19,34.77
  Bottom Layer w0.254: U1_L1.2 45.47,55.12 45.21,54.86 45.21,35.18 43.18,33.15 17.78,33.15 17.32,33.6 U4.15 13.26,33.6 12.19,34.67 v1(12.19,34.75)
PWM2: length 43.7
  Top Layer w0.254: v1(12.19,32.77) R8.2
  Bottom Layer w0.254: v1(12.19,32.77) 12.63,32.33 U4.16 15.14,32.51 43.56,32.51 46.1,35.05 46.1,39.24 47.12,40.26 48.49,40.26 U1_R1.2
PWM3: length 45.8
  Top Layer w0.254: 12.45,30.73 R10.2
  Bottom Layer w0.254: U1_L2.2 45.97,23.62 45.59,24 45.59,30.99 44.58,32 18.13,32 17.19,31.06 U4.17 12.77,31.06 12.45,30.73
  vias: v1(12.19,30.73)
PWM4: length 59.7
  Top Layer w0.254: v1(12.19,28.83) 11.04,28.83 R9.2
  Bottom Layer w0.254: U1_R2.2 46.99,8.64 44.96,10.67 44.96,30.35 43.94,31.37 18.76,31.37 17.19,29.79 U4.18 14.89,29.72 13.36,29.72 13.36,29.62 12.57,28.83 v1(12.19,28.83)
$3N995: length 9.5
  Top Layer w0.508: v1(35.05,50.04) 34.29,49.27 Q2_L1.1
  Bottom Layer w0.508: R2_L1.2 36.84,54.36 35.81,54.36 35.15,53.7 D2_L1.2 35.05,51.97 v1(35.05,50.04)
$3N996: length 7.9
  Bottom Layer w0.508: R1_L1.1 38.22,59.18 39.37,59.18 40.13,58.42 40.13,57.25 D1_L1.1 40.03,55.47 40.39,55.12 U1_L1.7
$3N997: length 6.3
  Bottom Layer w0.381: D2_L1.1 40.79,52.58 U1_L1.5
  Bottom Layer w0.508: R2_L1.1 38.47,54.36 39.62,54.36 40.28,53.7 D2_L1.1
$3N999: length 4.8
  Bottom Layer w0.508: C2_L1.1 43.65,60.3 D5_L1.1
  Bottom Layer w0.762: U1_L1.8 42.57,57.68 43.31,58.42 D5_L1.1
$3N1006: length 8.9
  Bottom Layer w0.508: U1_R1.7 40.89,40.13 40.03,41 D1_R1.1 39.88,42.95 39.88,44.58 39.5,44.96 37.93,44.96
$3N1007: length 8.5
  Top Layer w0.508: v1(34.42,41.15) 34.29,41.02 32.14,41.02 Q1_R1.1
  Bottom Layer w0.508: 36.43,44.96 35.31,44.96 34.67,44.32 34.67,43.03 D1_R1.2 34.9,41.63 v1(34.42,41.15)
$3N1008: length 6.7
  Bottom Layer w0.508: R2_R1.1 39.5,40.39 40.28,39.6 D2_R1.1 40.67,37.59 U1_R1.5
$3N1009: length 11.1
  Top Layer w0.508: v1(34.93,34.67) 34.93,34.27 34.29,33.64 Q2_R1.1
  Bottom Layer w0.508: R2_R1.2 35.69,40.39 34.93,39.62 34.93,38.2 D2_R1.2 34.93,37.74 v1(34.93,34.67)
$3N1011: length 4.4
  Bottom Layer w0.508: 43.24,45.59 43.24,43.66 D5_R1.1 43.18,43.51 43.18,41.76 U1_R1.8
$3N1019: length 9.2
  Top Layer w0.381: v1(33.66,55.12) 33.15,55.12 31.69,56.58 Q1_L1.1
  Bottom Layer w0.381: D1_L1.2 34.9,55.73 34.29,55.12 v1(33.66,55.12)
  Bottom Layer w0.508: D1_L1.2 34.9,58.52 35.56,59.18 36.43,59.18
$3N2169: length 9.6
  Top Layer w0.508: v1(34.42,18.54) 33.84,17.96 Q2_L2.1
  Bottom Layer w0.508: 36.46,23.75 35.43,23.75 34.9,23.22 D2_L2.2 ; v1(34.42,18.54) 34.42,20.47
  Bottom Layer w0.762: 34.42,20.47 D2_L2.2
$3N2170: length 10.2
  Bottom Layer w0.508: 40,27.71 40,27.91 40.03,27.94 ; 40,27.71 40,24.89 41.28,23.62 U1_L2.7 ; 40,27.71 39.88,27.84 39.88,29.21 39.37,29.72 38.04,29.72 37.96,29.79 R1_L2.1
$3N2171: length 7.2
  Bottom Layer w0.381: U1_L2.5 42.69,20.95 D2_L2.1
  Bottom Layer w0.508: 37.96,23.75 39.24,23.75 40,22.99 40,20.98 D2_L2.1
$3N2173: length 5.1
  Bottom Layer w0.508: C2_L2.1 43.02,29.6 43.14,29.72 D5_L2.1 43.14,25.21 U1_L2.8
$3N2190: length 9.2
  Bottom Layer w0.508: 38.22,14.35 39.12,14.35 39.65,13.82 D1_R2.1 39.65,9.76 40.77,8.64 U1_R2.7
$3N2191: length 8.7
  Top Layer w0.508: v1(33.66,9.65) 32.16,9.65 31.69,10.12
  Bottom Layer w0.508: R1_R2.2 35.31,14.35 34.51,13.56 D1_R2.2 34.51,10.51 v1(33.66,9.65)
$3N2192: length 7.5
  Bottom Layer w0.508: R2_R2.1 39.24,7.49 39.75,6.98 39.75,4.72 D2_R2.1 41.29,4.7 U1_R2.5
$3N2193: length 9.3
  Top Layer w0.508: Q2_R2.1 33.91,2.28 v1(34.42,2.79)
  Bottom Layer w0.508: R2_R2.2 35.43,7.49 34.67,6.73 34.67,4.72 D2_R2.2 34.42,4.47 v1(34.42,2.79)
$3N2195: length 4.5
  Bottom Layer w0.508: 43.39,11.81 43.19,11.6 43.19,10.41 U1_R2.8 ; 43.39,11.81 43.39,11.81 43.27,11.81 ; 43.39,11.81 43.27,11.81 43.27,11.81 ; 43.27,11.81 C2_R2.1 ; 43.27,11.81 D5_R2.1
$3N2213: length 8.1
  Top Layer w0.508: Q1_L2.1 31.69,25.78 v1(34.29,25.78)
  Bottom Layer w0.508: R1_L2.2 35.49,29.84 34.9,29.26 34.9,26.39 v1(34.29,25.78)
$3N2727: length 1.8
  Top Layer w0.762: LED2.2 46.24,39.03 44.47,39.03
$3N2731: length 2.2
  Top Layer w0.762: R2.2 43.45,26.79 LED1.2
$3N3245: length 8.4
  Top Layer w0.762: 42.8,51.45 39.5,51.45 ; 39.5,51.45 39.34,51.61 ; 39.5,51.45 38,51.45 L1.1 37.3,50.81 37.3,48.44
$3N3247: length 1.9
  Top Layer w0.762: 46.73,45.53 R6.2
$3N3248: length 4.1
  Top Layer w0.762: R6.1 45.15,47.46 R5.1 45.15,51.32 U3.3
$3N3249: length 2.1
  Top Layer w0.762: R11.2 40.45,39.21 40.35,39.11
$3N4523: length 7.7
  Bottom Layer w0.381: U4.5 4.45,32.33 4.06,32.71 4.06,35.81 2.92,36.96 1.91,36.96
$3N4524: length 5.8
  Bottom Layer w0.381: U4.4 4.5,31.06 3.18,32.38 3.18,33.17 H1.3
$3N4525: length 4.8
  Bottom Layer w0.381: H1.4 4.01,29.79 U4.3
$3N4526: length 4.3
  Bottom Layer w0.381: U4.2 2.74,28.52 H1.5

## Copper pours and planes (outline as drawn; the poured copper is in the pictures)
GND on Top Layer: 36.83,67.56 40.64,67.56 40.64,63.63 36.83,63.63
PGND on Top Layer: 19.73,67.82 35.91,67.82 35.91,3.81 19.73,3.81
PGND on Bottom Layer: 30.23,23.37 33.08,23.37 33.08,20.1 30.23,20.1
PGND on Bottom Layer: 30.23,54.61 32.98,54.61 32.98,50.93 30.23,50.93
PGND on Bottom Layer: 30.23,7.62 33.02,7.62 33.02,3.81 30.23,3.81
PGND on Bottom Layer: 30.23,39.12 32.99,39.12 32.99,35.92 30.23,35.92
VBAT on Top Layer: 14.1,75 42.8,75 42.8,9.78 14.1,9.78
VBAT on Bottom Layer: 21.84,15.11 27.31,15.11 27.31,9.65 21.84,9.65
VBAT on Bottom Layer: 21.08,62.23 27.31,62.23 27.31,56.77 21.08,56.77
VBAT on Bottom Layer: 21.08,30.22 27.31,30.22 27.31,25.41 21.08,25.41
VBAT on Bottom Layer: 21.08,46.48 27.31,46.48 27.31,41.02 21.08,41.02
ML+ on Top Layer: 30.42,62.36 33.02,62.36 33.02,58.67 30.42,58.67
ML+ on Bottom Layer: 21.08,54.36 27.81,54.36 27.81,48.89 21.08,48.89
ML+ on Bottom Layer: 30.41,61.98 33.02,61.98 33.02,58.67 30.41,58.67
ML- on Top Layer: 30.35,46.74 32.91,46.74 32.91,43.76 30.35,43.76
ML- on Bottom Layer: 30.35,46.86 32.92,46.86 32.92,43.76 30.35,43.76
ML- on Bottom Layer: 20.97,38.86 27.18,38.86 27.18,33.55 20.97,33.55
MR+ on Top Layer: 30.35,30.99 33.02,30.99 33.02,27.68 30.35,27.68
MR+ on Bottom Layer: 21.08,22.99 27.31,22.99 27.31,17.27 21.08,17.27
MR+ on Bottom Layer: 30.35,30.35 32.89,30.35 32.89,27.69 30.35,27.69
MR- on Top Layer: 30.23,15.51 32.89,15.51 32.89,11.94 30.23,11.94
MR- on Bottom Layer: 30.23,15.51 32.89,15.51 32.89,11.94 30.23,11.94
MR- on Bottom Layer: 21.21,7.37 27.31,7.37 27.31,1.91 21.21,1.91
$3N4108 on Top Layer: 19.43,75.06 36.96,75.06 36.96,69.98 19.43,69.98

Small or netless copper shapes (teardrops, artwork), in the pictures only: 60 on Top Layer, 139 on Bottom Layer

## Text on the board
Bottom Silkscreen Layer: 104 | 10欧
Top Layer: 广东工业大学 / 共用电子队 / 2024
Top Silkscreen Layer: PWM2 | PWM3 | PWM4 | PWM1 | GND | 4.7k | 106 | 104 | 10k | 12v | 5v | 3.3v | 1k | 9.1k | -->ON | 0欧
